# Altium schematic sheet Sheet3.SchDoc
size A3
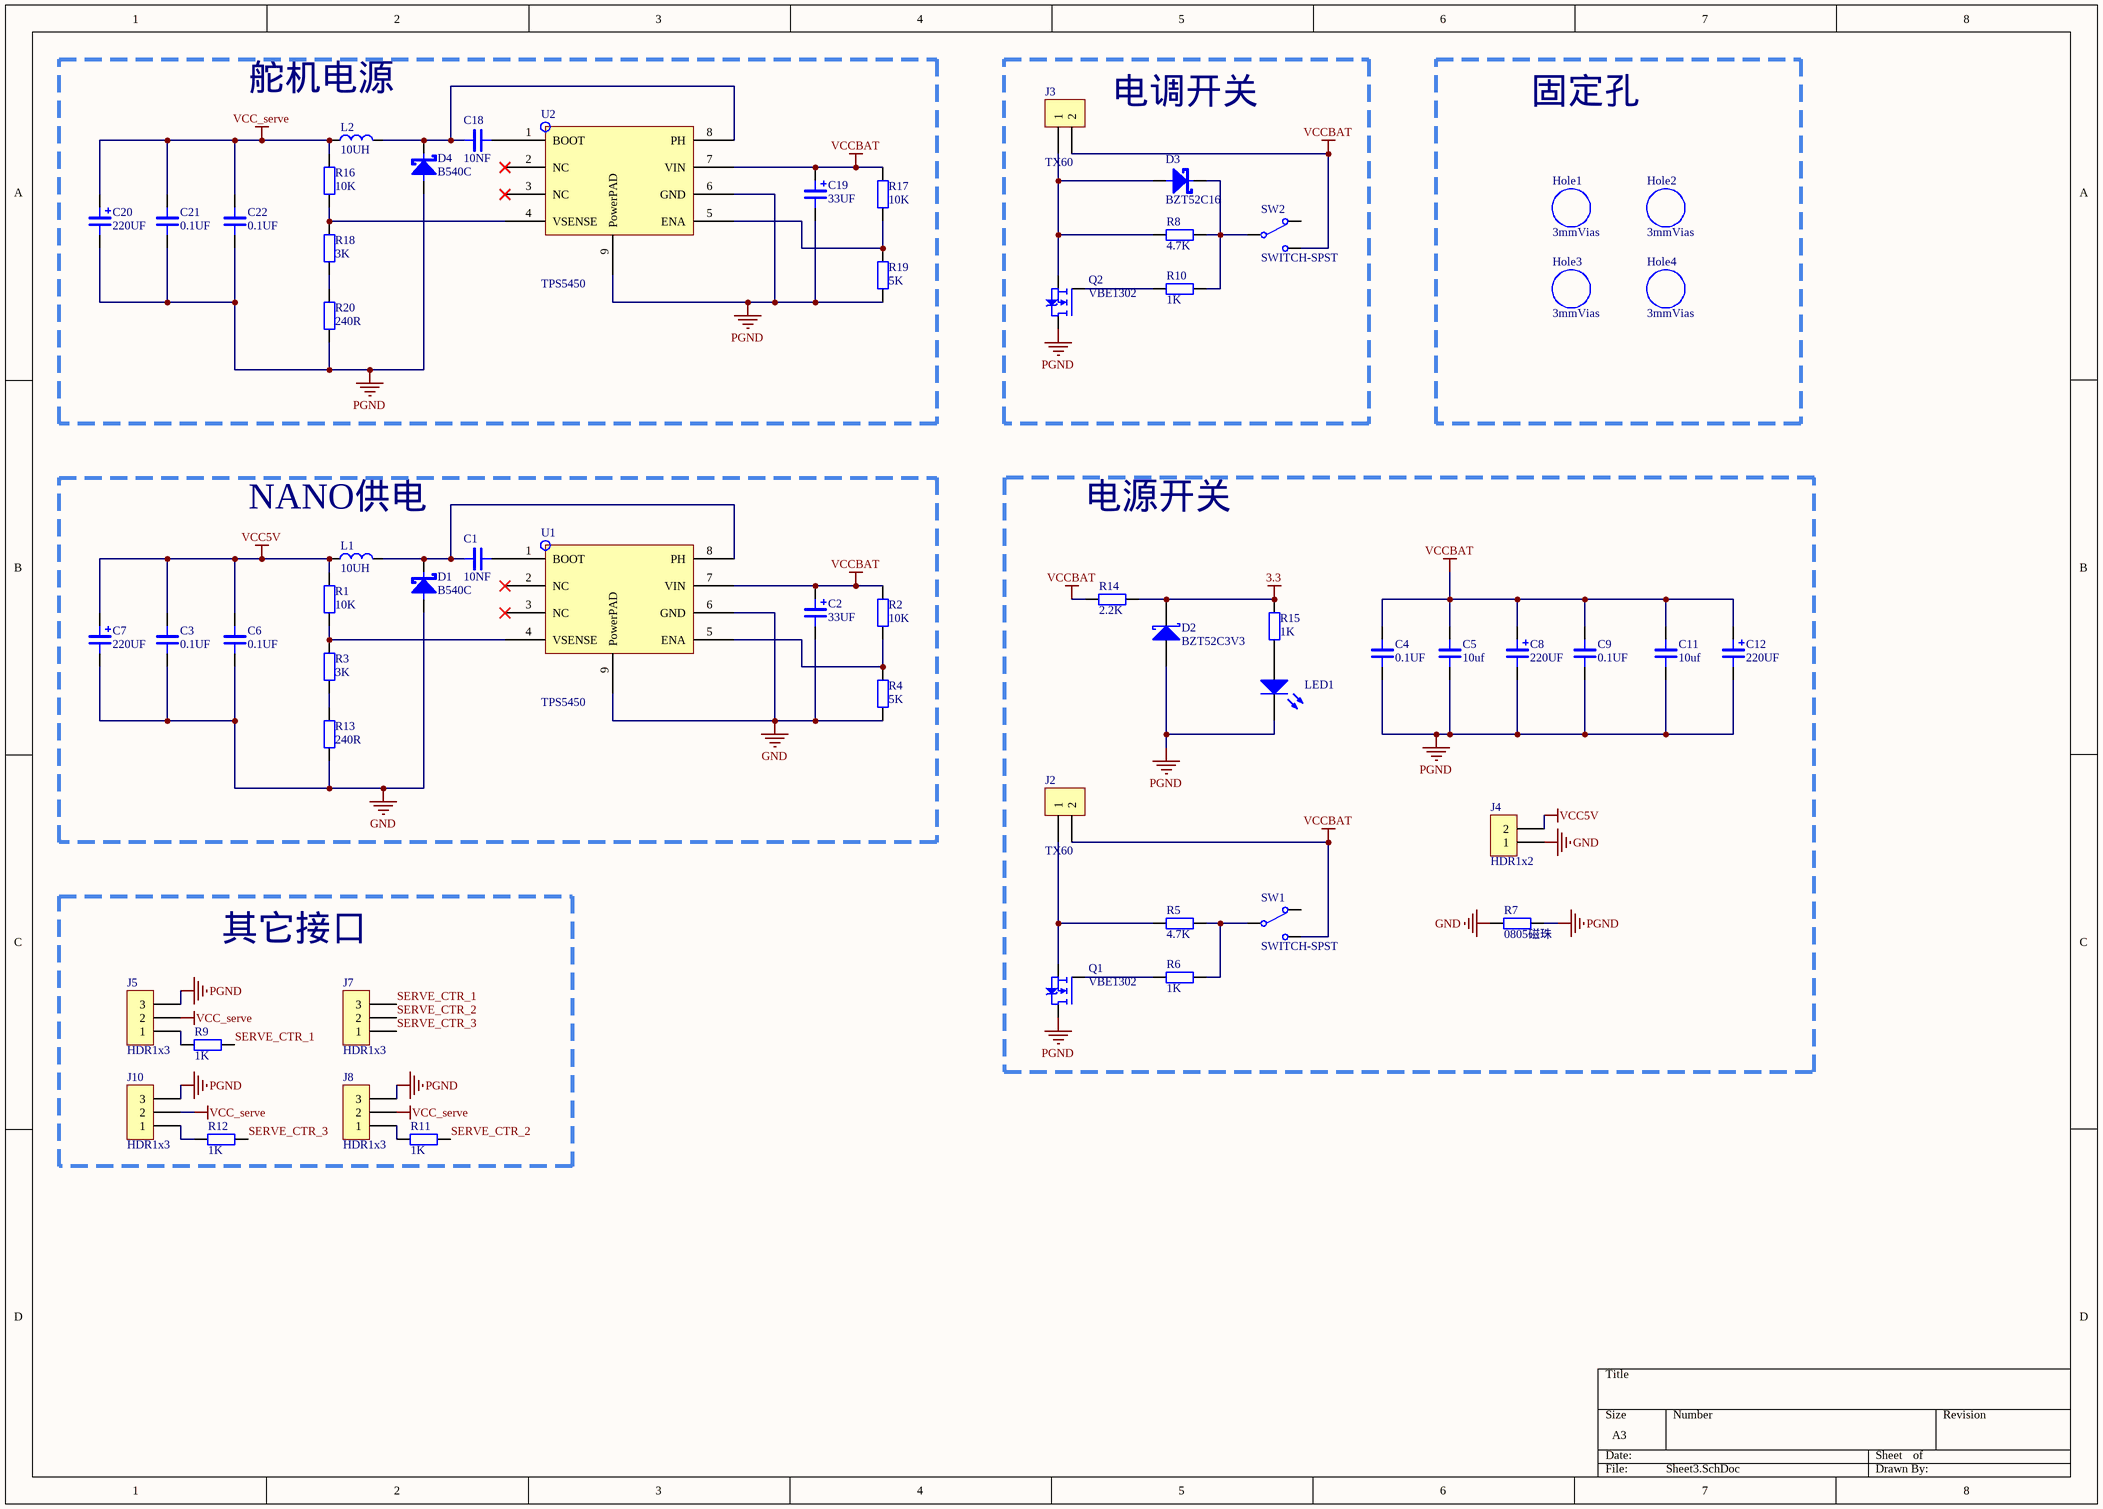
[diagram p0: Sheet3.SchDoc]

## Parts
C1  10NF  [0603]
C2  33UF  [DIP-EC2.5X5X11]
C3  0.1UF  [0603]
C4  0.1UF  [0603]
C5  10uf  [0603]
C6  0.1UF  [0603]
C7  220UF  [DIP-EC3.5X8X11.5]
C8  220UF  [DIP-EC3.5X8X11.5]
C9  0.1UF  [0603]
C11  10uf  [0603]
C12  220UF  [DIP-EC3.5X8X11.5]
C18  10NF  [0603]
C19  33UF  [DIP-EC2.5X5X11]
C20  220UF  [DIP-EC3.5X8X11.5]
C21  0.1UF  [0603]
C22  0.1UF  [0603]
D1  B540C  [B540C]
D2  BZT52C3V3  [sod123]
D3  BZT52C16  [sod123]
D4  B540C  [B540C]
Hole1  3mmVias  [3mm]
Hole2  3mmVias  [3mm]
Hole3  3mmVias  [3mm]
Hole4  3mmVias  [3mm]
J2  TX60  [焊盘]
J3  TX60  [焊盘]
J4  HDR1x2  [KF301]
J5  HDR1x3  [PIN-3-2.54-1.0]
J7  HDR1x3  [PIN-3-2.54-1.0]
J8  HDR1x3  [PIN-3-2.54-1.0]
J10  HDR1x3  [PIN-3-2.54-1.0]
L1  10UH  [CDRH74]
L2  10UH  [CDRH74]
LED1  LED0  [0603-led]  (value not drawn)
Q1  VBE1302  [TO-252-2]
Q2  VBE1302  [TO-252-2]
R1  10K  [0603]
R2  10K  [0603]
R3  3K  [0603]
R4  5K  [0603]
R5  4.7K  [0603]
R6  1K  [0603]
R7  0805磁珠  [0805]
R8  4.7K  [0603]
R9  1K  [0603]
R10  1K  [0603]
R11  1K  [0603]
R12  1K  [0603]
R13  240R  [0603]
R14  2.2K  [0603]
R15  1K  [0603]
R16  10K  [0603]
R17  10K  [0603]
R18  3K  [0603]
R19  5K  [0603]
R20  240R  [0603]
SW1  SWITCH-SPST  [ss12d10]
SW2  SWITCH-SPST  [ss12d10]
U1  TPS5450  [TPS5450]
U2  TPS5450  [TPS5450]

## Blocks framed on the sheet
舵机电源: C18-C22 D4 L2 R16-R20 U2
电调开关: D3 J3 Q2 R8 R10 SW2
固定孔: Hole1-Hole4
NANO供电: C1-C3 C6 C7 D1 L1 R1-R4 R13 U1
电源开关: C4 C5 C8 C9 C11 C12 D2 J2 J4 LED1 Q1 R5-R7 R14 R15 SW1
其它接口: J5 J7 J8 J10 R9 R11 R12

## Nets
3.3: D2.1(K) R14.1 R15.1
GND: C2.2 C3.1 C6.1 C7.2 D1.1(A) J4.1 R4.1 R7.2 R13.1 U1.6(GND) U1.9(PowerPAD)
PGND: C4.1 C5.1 C8.2 C9.1 C11.1 C12.2 C19.2 C20.2 C21.1 C22.1 D2.3(A) D4.1(A) J5.3 J8.3 J10.3 LED1.2(K) Q1.4(D) Q2.4(D) R7.1 R19.1 R20.1 U2.6(GND) U2.9(PowerPAD)
VCC5V: C3.2 C6.2 C7.1 J4.2 L1.1 R1.2
VCC_serve: C20.1 C21.2 C22.2 J5.2 J8.2 J10.2 L2.1 R16.2
VCCBAT: C2.1 C4.2 C5.2 C8.1 C9.2 C11.2 C12.1 C19.1 J2.2 J3.2 R2.2 R14.2 R17.2 SW1.3 SW2.3 U1.7(VIN) U2.7(VIN)
SERVE_CTR_1: J7.3 R9.2
SERVE_CTR_2: J7.2 R11.2
SERVE_CTR_3: J7.1 R12.2
NetC1_1: C1.1 U1.1(BOOT)
NetC1_2: C1.2 D1.2(C) L1.2 U1.8(PH)
NetC18_1: C18.1 U2.1(BOOT)
NetC18_2: C18.2 D4.2(C) L2.2 U2.8(PH)
NetD3_1: D3.1(A) J3.1 Q2.3(S) R8.1
NetD3_2: D3.2(C) R8.2 R10.2 SW2.2
NetJ2_1: J2.1 Q1.3(S) R5.1
NetJ5_1: J5.1 R9.1
NetJ8_1: J8.1 R11.1
NetJ10_1: J10.1 R12.1
NetLED1_1: LED1.1(A) R15.2
NetQ1_1: Q1.1(G) R6.1
NetQ2_1: Q2.1(G) R10.1
NetR1_1: R1.1 R3.2 U1.4(VSENSE)
NetR2_1: R2.1 R4.2 U1.5(ENA)
NetR3_1: R3.1 R13.2
NetR5_2: R5.2 R6.2 SW1.2
NetR16_1: R16.1 R18.2 U2.4(VSENSE)
NetR17_1: R17.1 R19.2 U2.5(ENA)
NetR18_1: R18.1 R20.2

Not connected (* = marked no-connect by the designer): SW1 1; SW2 1; U1 2(NC)* 3(NC)*; U2 2(NC)* 3(NC)*

## Library data of the parts
C1 C3-C6 C9 C11 C18 C21 C22 = CAP: Capacitor
C2 C7 C8 C12 C19 C20 = CAP-TANTALUM: Tantalum Capacitor
D1 D3 D4 = SS5x: Schottky Diode
D2 = Diode 18TQ045: Schottky Rectifier; Note: Terminal 2 is the TAB and is electrically connected to the cathode; Published: 8-Jun-2000; LatestRevisionDate: 17-Jul-2002; LatestRevisionNote: Re-released for DXP Platform.; DatasheetVersion: Dec-1997; PackageVersion: Feb-1998; PackageReference: TO-220AC; Publisher: Altium Limited; PackageDescription: TO, Thru-Hole, Vertical, Heatsink Mounted; 3 In-Line Leads (1 Absent); Pitch 2.54 mm; ComponentLink1Description: Manufacturer Link; ComponentLink1URL: http://www.irf.com/; ComponentLink2Description: Datasheet; ComponentLink2URL: http://www.irf.com/product-info/datasheets/data/18tq.pdf
J2-J4 = HDR1x2: Connector
J5 J7 J8 J10 = HDR1x3: Connector
L1 L2 = INDUCTANCE
LED1 = LED0: Typical INFRARED GaAs LED; Published: 8-Jun-2000; LatestRevisionDate: 08-Jul-2005; LatestRevisionNote: Mech Layer 1 removed.; PackageReference: LED-0; Publisher: Altium Limited; PackageDescription: LED; 2 Leads
Q1 Q2 = FDB52N20: N-Channel MOSFET
R1-R20 = RES: Resistor
SW1 SW2 = SWITCH-SPST: Switch